# EAGLE design baseboard (EAGLE 5.10)

## Sheet 1 of 3
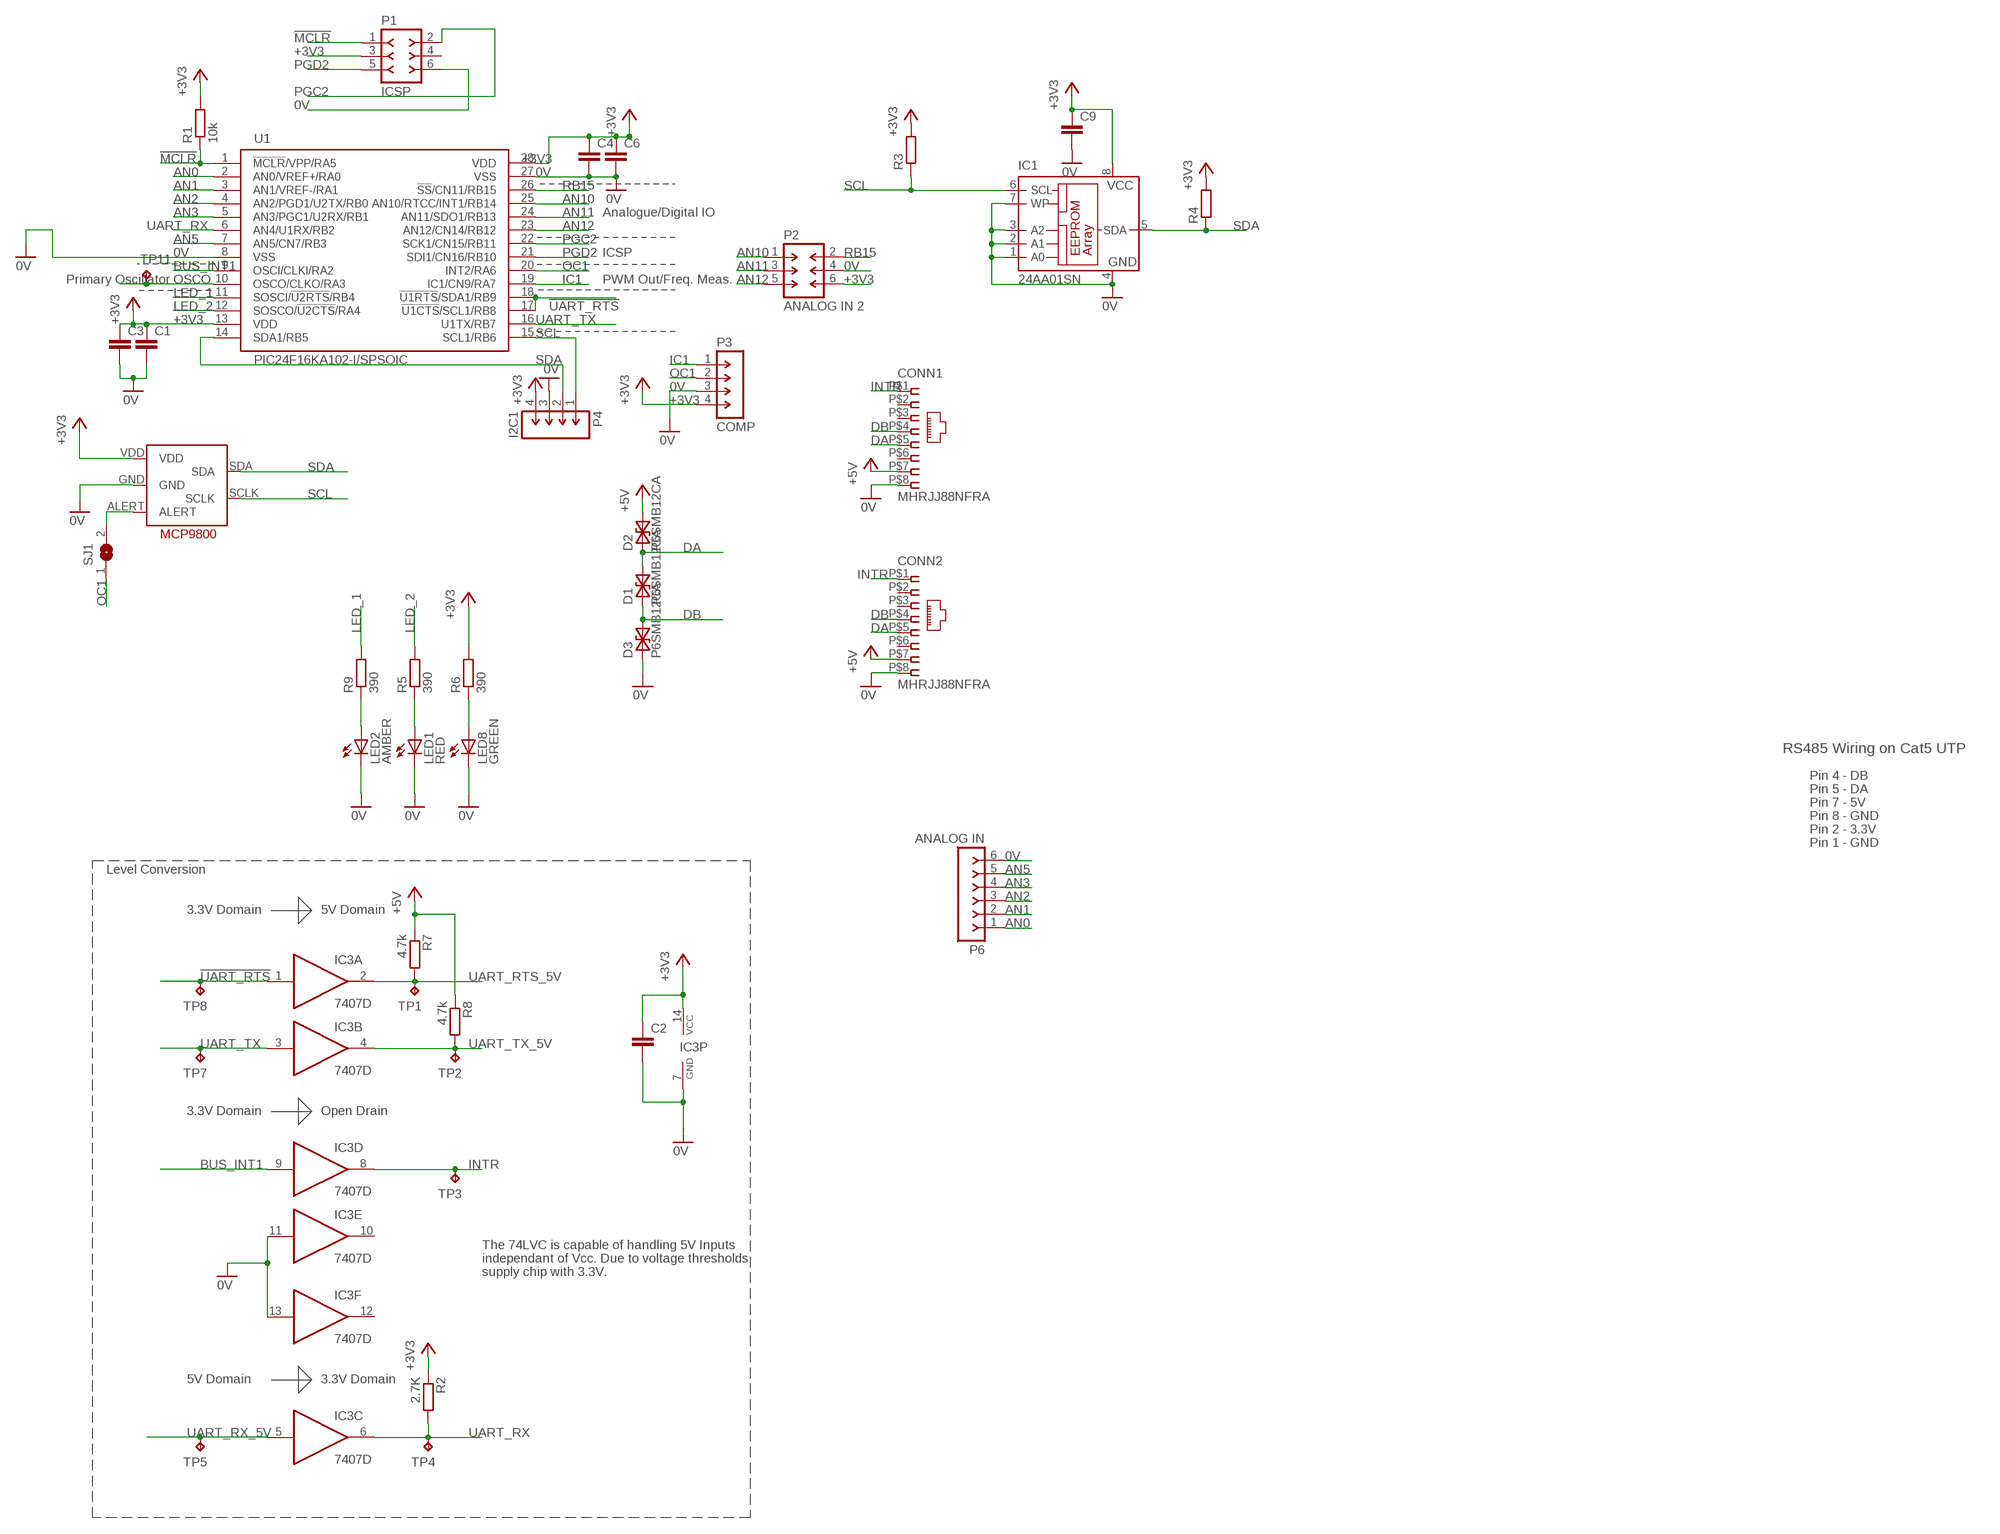
[diagram p0: schematic, sheet 1]

### Parts
C1  C-EUC0603  [C0603]
C2  C-EUC0603  [C0603]
C3  C-EUC0603  [C0603]
C4  C-EUC0603  [C0603]
C6  C-EUC0603  [C0603]
C9  C-EUC0603  [C0603]
CONN1  MHRJJ88NFRA  [MHRJJ8NFRA]
CONN2  MHRJJ88NFRA  [MHRJJ8NFRA]
D1  P6SMB12CA  [SMB]
D2  P6SMB12CA  [SMB]
D3  P6SMB12CA  [SMB]
IC1  24AA01SN  [SO-08]
IC3  7407D  [SO14]
LED1  RED  LEDP-LCC-2  [P-LCC-2]
LED2  AMBER  LEDP-LCC-2  [P-LCC-2]
LED8  GREEN  LEDP-LCC-2  [P-LCC-2]
P1  ICSP  F-2X03-DIL-100  [DIL-100-2X03]
P2  ANALOG IN 2  M-2X03-DIL-100  [DIL-100-2X03]
P3  COMP  M-1X04-SIP-100-40  [SIP-100-04-40]
P4  I2C1  M-1X04-SIP-100-40  [SIP-100-04-40]
P6  ANALOG IN  F-1X06-SIP-100-40  [SIP-100-06-40]
R1  10k  R-EU_R0805  [R0805]
R2  2.7K  R-EU_R0805  [R0805]
R3  R-EU_R0805  [R0805]
R4  R-EU_R0805  [R0805]
R5  390  R-EU_R0805  [R0805]
R6  390  R-EU_R0805  [R0805]
R7  4.7k  R-EU_R0805  [R0805]
R8  4.7k  R-EU_R0805  [R0805]
R9  390  R-EU_R0805  [R0805]
SJ1  SJ  [SJ]
TP1  TPTP13R  [TP13R]
TP2  TPTP13R  [TP13R]
TP3  TPTP13R  [TP13R]
TP4  TPTP13R  [TP13R]
TP5  TPTP13R  [TP13R]
TP7  TPTP13R  [TP13R]
TP8  TPTP13R  [TP13R]
TP11  TPTP13R  [TP13R]
U1  PIC24F16KA102-I/SPSOIC  [SO28W]
U$1  MCP9800  [SOT-23-5]

### Nets
0V: C1.2 C2.2 C3.2 C4.2 C6.2 C9.2 CONN1.P$8 CONN2.P$8 D3.1 IC1.1(A0) IC1.2(A1) IC1.3(A2) IC1.4(GND) IC1.7(WP) IC3.7(P:GND) IC3.11(E:I) IC3.13(F:I) LED1.C LED2.C LED8.C P1.6 P2.4 P3.3 P4.3 P6.6 U1.8(VSS) U1.27(VSS) U$1.GND ; also sheet 2,3
!MCLR!: P1.1 R1.1 U1.1(!MCLR!/VPP/RA5)
!UART_RTS!: IC3.1(A:I) TP8.TP U1.17(!U1CTS!/SCL1/RB8) U1.18(!U1RTS!/SDA1/RB9)
+3V3: C1.1 C2.1 C3.1 C4.1 C6.1 C9.1 IC1.8(VCC) IC3.14(P:VCC) P1.3 P2.6 P3.4 P4.4 R1.2 R2.1 R3.2 R4.2 R6.2 U1.13(VDD) U1.28(VDD) U$1.VDD ; also sheet 2
+5V: CONN1.P$7 CONN2.P$7 D2.2 R7.1 R8.1 ; also sheet 2,3
AN0: P6.1 U1.2(AN0/VREF+/RA0)
AN1: P6.2 U1.3(AN1/VREF-/RA1)
AN2: P6.3 U1.4(AN2/PGD1/U2TX/RB0)
AN3: P6.4 U1.5(AN3/PGC1/U2RX/RB1)
AN5: P6.5 U1.7(AN5/CN7/RB3)
AN10: P2.1 U1.25(AN10/RTCC/INT1/RB14)
AN11: P2.3 U1.24(AN11/SDO1/RB13)
AN12: P2.5 U1.23(AN12/CN14/RB12)
BUS_INT1: IC3.9(D:I) U1.9(OSCI/CLKI/RA2)
DA: CONN1.P$5 CONN2.P$5 D1.2 D2.1 ; also sheet 3
DB: CONN1.P$4 CONN2.P$4 D1.1 D3.2 ; also sheet 3
IC1: P3.1 U1.19(IC1/CN9/RA7)
INTR: CONN1.P$1 CONN2.P$1 IC3.8(D:O) TP3.TP
LED_1: R9.2 U1.11(SOSCI/!U2RTS!/RB4)
LED_2: R5.2 U1.12(SOSCO/!U2CTS!/RA4)
N$4: SJ1.2 U$1.ALERT
N$5: LED1.A R5.1
N$6: LED2.A R9.1
N$15: LED8.A R6.1
OC1: P3.2 SJ1.1 U1.20(INT2/RA6)
OSCO: TP11.TP U1.10(OSCO/CLKO/RA3)
PGC2: P1.2 U1.22(SCK1/CN15/RB11)
PGD2: P1.5 U1.21(SDI1/CN16/RB10)
RB15: P2.2 U1.26(!SS!/CN11/RB15)
SCL: IC1.6(SCL) P4.1 R3.1 U1.15(SCL1/RB6) U$1.SCLK
SDA: IC1.5(SDA) P4.2 R4.1 U1.14(SDA1/RB5) U$1.SDA
UART_RTS_5V: IC3.2(A:O) R7.2 TP1.TP ; also sheet 3
UART_RX: IC3.6(C:O) R2.2 TP4.TP U1.6(AN4/U1RX/RB2)
UART_RX_5V: IC3.5(C:I) TP5.TP ; also sheet 3
UART_TX: IC3.3(B:I) TP7.TP U1.16(U1TX/RB7)
UART_TX_5V: IC3.4(B:O) R8.2 TP2.TP ; also sheet 3
Unconnected: CONN1.P$2 CONN1.P$3 CONN1.P$6 CONN2.P$2 CONN2.P$3 CONN2.P$6 IC3.10(E:O) IC3.12(F:O) P1.4

### Notes on the sheet
- Analogue/Digital IO
- ICSP
- Primary Oscillator | PWM Out/Freq. Meas.
- RS485 Wiring on Cat5 UTP
- Pin 4 - DB
- Pin 5 - DA
- Pin 7 - 5V
- Pin 8 - GND
- Pin 2 - 3.3V
- Pin 1 - GND
- Level Conversion
- 3.3V Domain | 5V Domain
- 3.3V Domain | Open Drain
- The 74LVC is capable of handling 5V Inputs
- independant of Vcc. Due to voltage thresholds
- supply chip with 3.3V.
- 5V Domain | 3.3V Domain

## Sheet 2 of 3
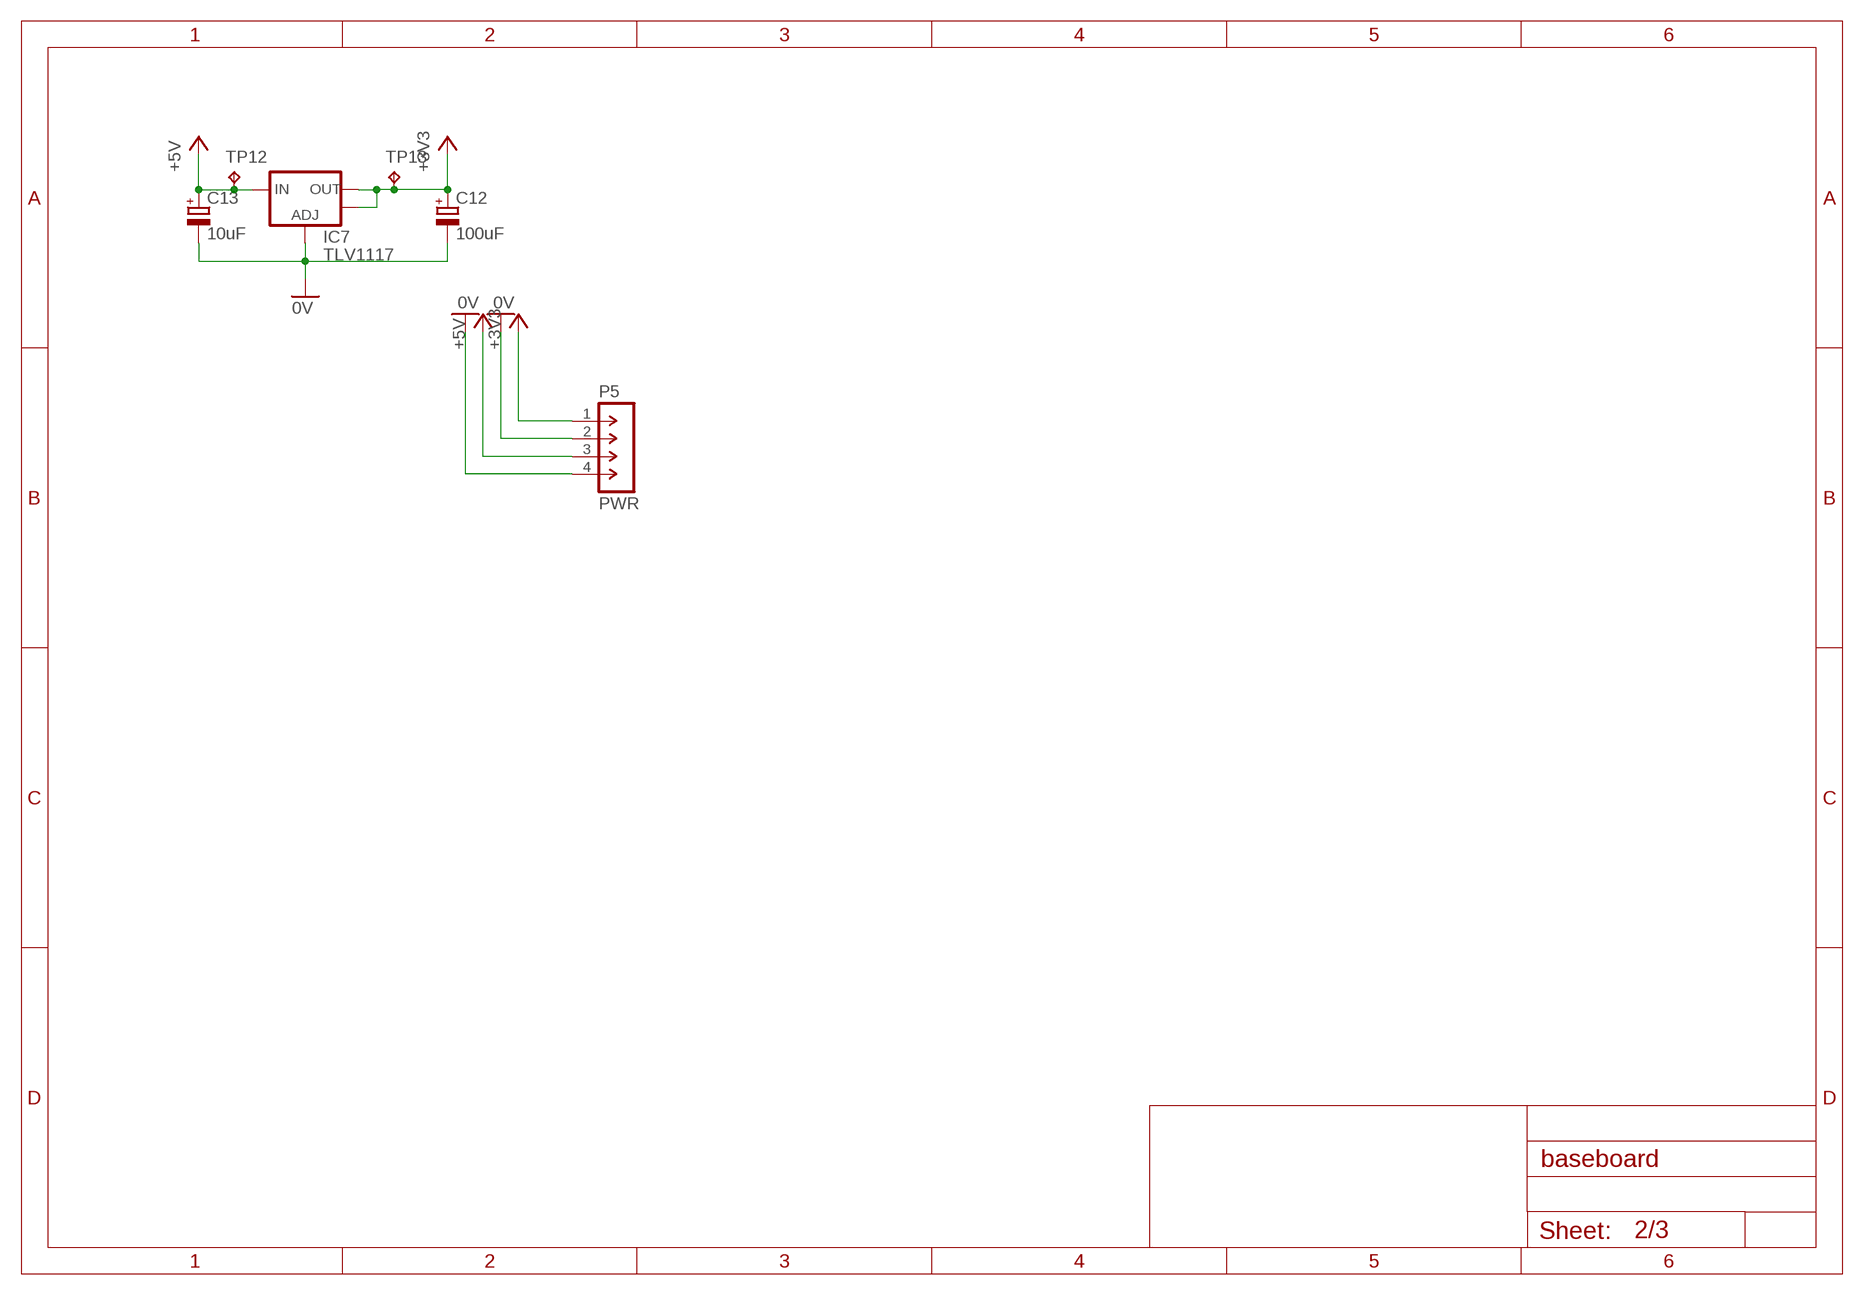
[diagram p1: schematic, sheet 2]

### Parts
C12  100uF  CPOL-EUB/3528-21R  [B/3528-21R]
C13  10uF  CPOL-EUC/6032-28R  [C/6032-28R]
IC7  TLV1117  V_REG_LM1117SOT223  [SOT223]
P5  PWR  M-1X04-SIP-100-40  [SIP-100-04-40]
TP12  TPTP15R  [TP15R]
TP13  3V3  TPTP15R  [TP15R]

### Nets
0V: C12.- C13.- IC7.1(ADJ) P5.2 P5.4 ; also sheet 1,3
+3V3: C12.+ IC7.2(OUT) IC7.4(OUT) P5.1 TP13.TP ; also sheet 1
+5V: C13.+ IC7.3(IN) P5.3 TP12.TP ; also sheet 1,3

## Sheet 3 of 3
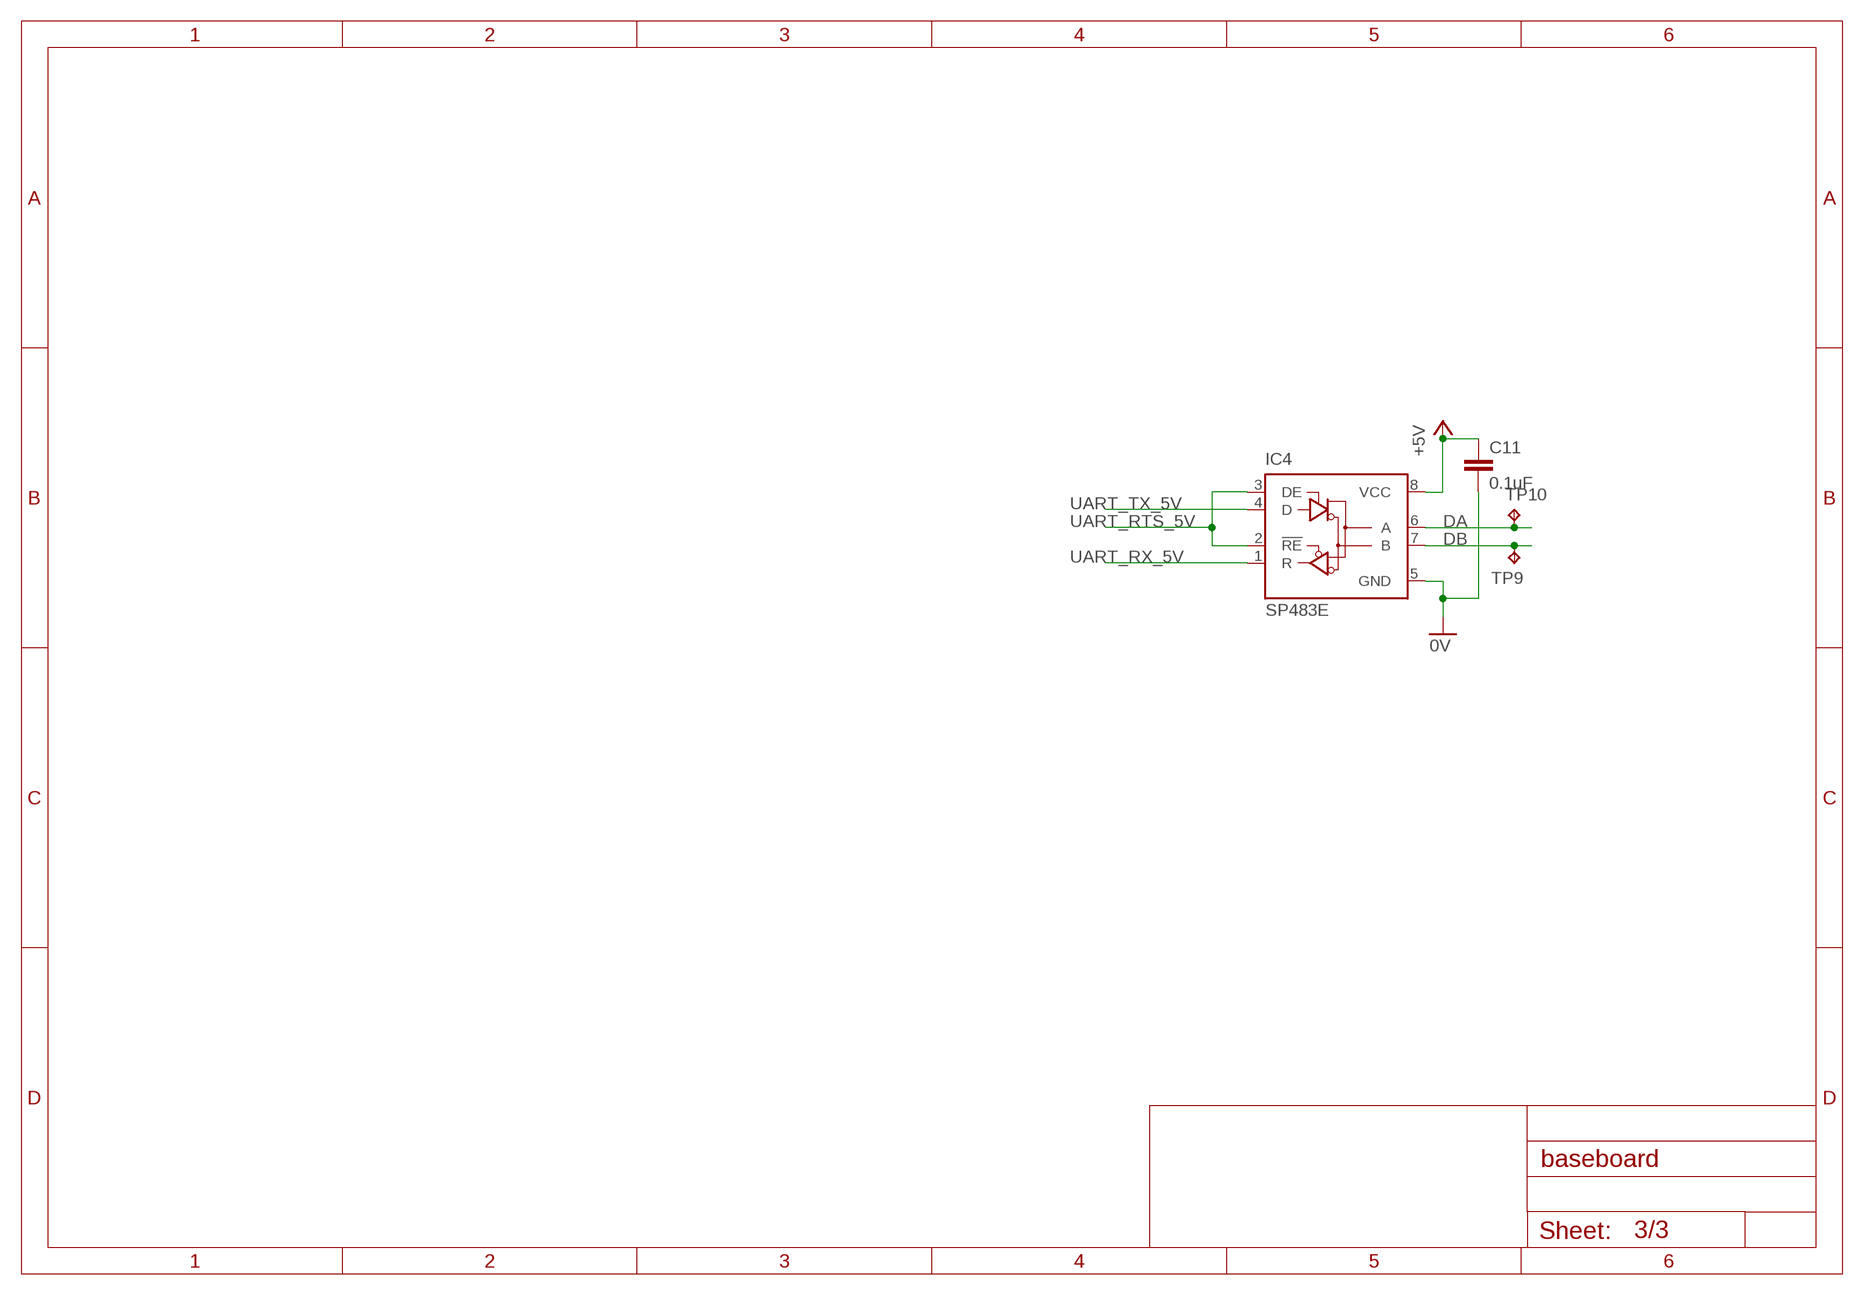
[diagram p2: schematic, sheet 3]

### Parts
C11  0.1uF  C-EUC1206  [C1206]
IC4  SP483E  75176AD  [D_R-PDSO-G8]
TP9  TPTP13R  [TP13R]
TP10  TPTP13R  [TP13R]

### Nets
0V: C11.2 IC4.5(GND) ; also sheet 1,2
+5V: C11.1 IC4.8(VCC) ; also sheet 1,2
DA: IC4.6(A) TP10.TP ; also sheet 1
DB: IC4.7(B) TP9.TP ; also sheet 1
UART_RTS_5V: IC4.2(!RE) IC4.3(DE) ; also sheet 1
UART_RX_5V: IC4.1(R) ; also sheet 1
UART_TX_5V: IC4.4(D) ; also sheet 1

## Library data of the parts
C1-C4 C6 C9 C11 = resistor:C-EU: CAPACITOR, European symbol
C12 C13 = resistor:CPOL-EU: POLARIZED CAPACITOR, European symbol
CONN1 CONN2 = eko-parts:MHRJJ88NFRA: http://onecall.farnell.com/mh-connectors/mhrjj88nfra/socket-rj45-8p8c/dp/3938360
D1-D3 = _hhn_suppressor_SMAJ_SM6T_P6SMB:P6SMB*CA: P6SMBxxCA Series of bidirectional Transient Voltage Suppressor Diodes xx = Stand-off Voltage VR in Volts; PPmax = 600 W Case: SMB = DO 214 AA Note: Footprint acc. to ST specs; source: www.st.com Author: Dipl.-Ing. FH Rainer Bayer, www.ing-rb.de/hhn Feedback: rainer.bayer@hs-heilbronn.de
IC1 = microchip:24*: Serial EEPROM I2C; MF: MICROCHIP; MPN: 24AA01/SN; OC_FARNELL: 1331268; OC_NEWARK: 89C9792
IC3 = 74xx-eu:74*07: Hex BUFFER, open collector high-voltage output
IC4 = 751xx:75176A: DIFFERENTIAL BUS TRANSCEIVER Source: http://focus.ti.com/lit/ds/symlink/sn75176a.pdf
IC7 = SparkFun:V_REG_LM1117: Voltage Regulator LM1117 Standard adjustable voltage regulator but in SMD form. Spark Fun Electronics SKU : COM-00595
LED1 LED2 LED8 = led:LED: LED OSRAM: - CHIPLED LG R971, LG N971, LY N971, LG Q971, LY Q971, LO R971, LY R971 LH N974, LH R974 LS Q976, LO Q976, LY Q976 LO Q996 - Hyper CHIPLED LW Q18S LB Q993, LB Q99A, LB R99A - SideLED LS A670, LO A670, LY A670, LG A670, LP A670 LB A673, LV A673, LT A673, LW A673 LH A674 LY A675 LS A676, LA A676, LO A676, LY A676, LW A676 LS A679, LY A679, LG A679 - Hyper Micro SIDELED® LS Y876, LA Y876, LO Y876, LY Y876 LT Y87S - SmartLED LW L88C, LW L88S LB L89C, LB L89S, LG L890 LS L89K, LO L89K, LY L89K LS L896, LA L896, LO L896, LY L896 - TOPLED LS T670, LO T670, LY T670, LG T670, LP T670 LSG T670, LSP T670, LSY T670, LOP T670, LYG T670 LG T671, LOG T671, LSG T671 LB T673, LV T673, LT T673, LW T673 LH T674 LS T676, LA T676, LO T676, LY T676, LB T676, LH T676, LSB T676, LW T676 LB T67C, LV T67C, LT T67C, LS T67K, LO T67K, LY T67K, LW E67C LS E67B, LA E67B, LO E67B, LY E67B, LB E67C, LV E67C, LT E67C LW T67C LS T679, LY T679, LG T679 LS T770, LO T770, LY T770, LG T770, LP T770 LB T773, LV T773, LT T773, LW T773 LH T774 LS E675, LA E675, LY E675, LS T675 LS T776, LA T776, LO T776, LY T776, LB T776 LHGB T686 LT T68C, LB T68C - Hyper Mini TOPLED® LB M676 - Mini TOPLED Santana® LG M470 LS M47K, LO M47K, LY M47K Source: http://www.osram.convergy.de LUXEON: - LUMILED® LXK2-PW12-R00, LXK2-PW12-S00, LXK2-PW14-U00, LXK2-PW14-V00 LXK2-PM12-R00, LXK2-PM12-S00, LXK2-PM14-U00 LXK2-PE12-Q00, LXK2-PE12-R00, LXK2-PE12-S00, LXK2-PE14-T00, LXK2-PE14-U00 LXK2-PB12-K00, LXK2-PB12-L00, LXK2-PB12-M00, LXK2-PB14-N00, LXK2-PB14-P00, LXK2-PB14-Q00 LXK2-PR12-L00, LXK2-PR12-M00, LXK2-PR14-Q00, LXK2-PR14-R00 LXK2-PD12-Q00, LXK2-PD12-R00, LXK2-PD12-S00 LXK2-PH12-R00, LXK2-PH12-S00 LXK2-PL12-P00, LXK2-PL12-Q00, LXK2-PL12-R00 Source: www.luxeon.com KINGBRIGHT: KA-3528ASYC Source: www.kingbright.com
P1 = con-headers-jp:F-2X03-: FEMALE HEADER
P2 = con-headers-jp:M-2X03-: MALE HEADER
P3-P5 = con-headers-jp:M-1X04-: MALE HEADER
P6 = con-headers-jp:F-1X06-: FEMALE HEADER
R1-R9 = resistor:R-EU_: RESISTOR, European symbol
SJ1 = jumper:SJ: SMD solder JUMPER
TP1-TP5 TP7-TP13 = testpad:TP: Test pad
U1 = eko-parts:PIC24F16KA102-I/SP
U$1 = atmospheric:MCP9800

## Board
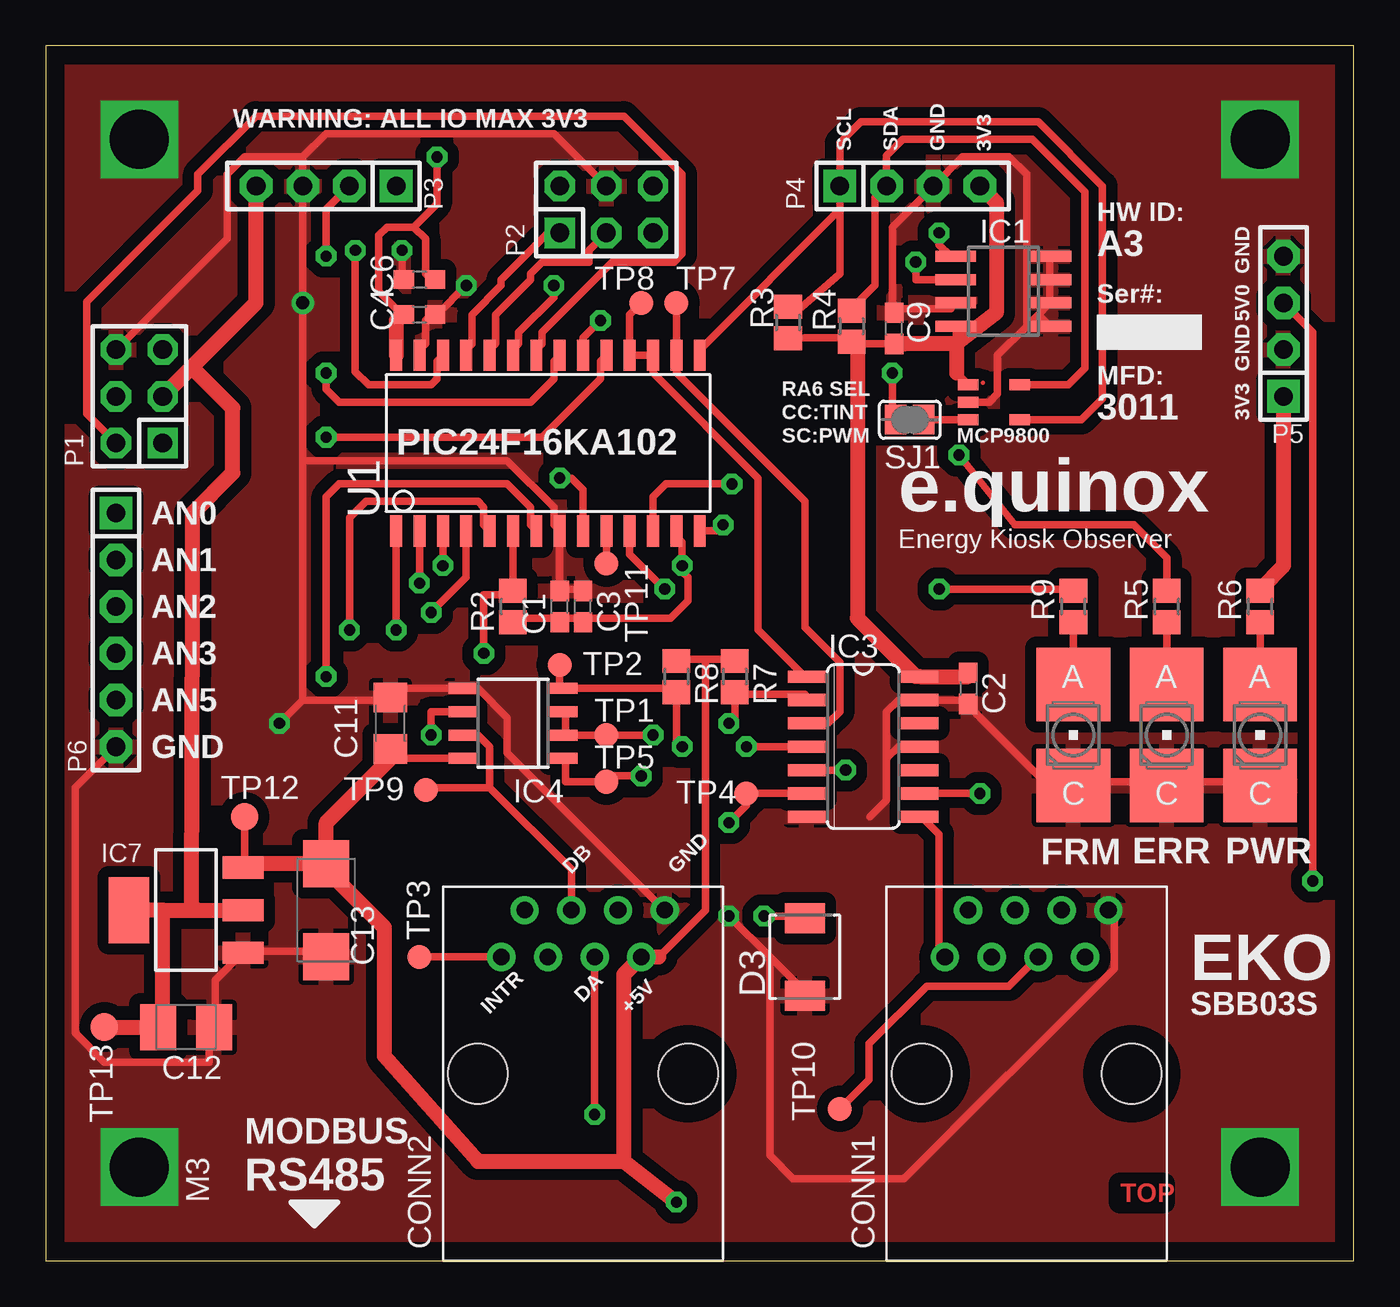
[diagram p3: board, top side]
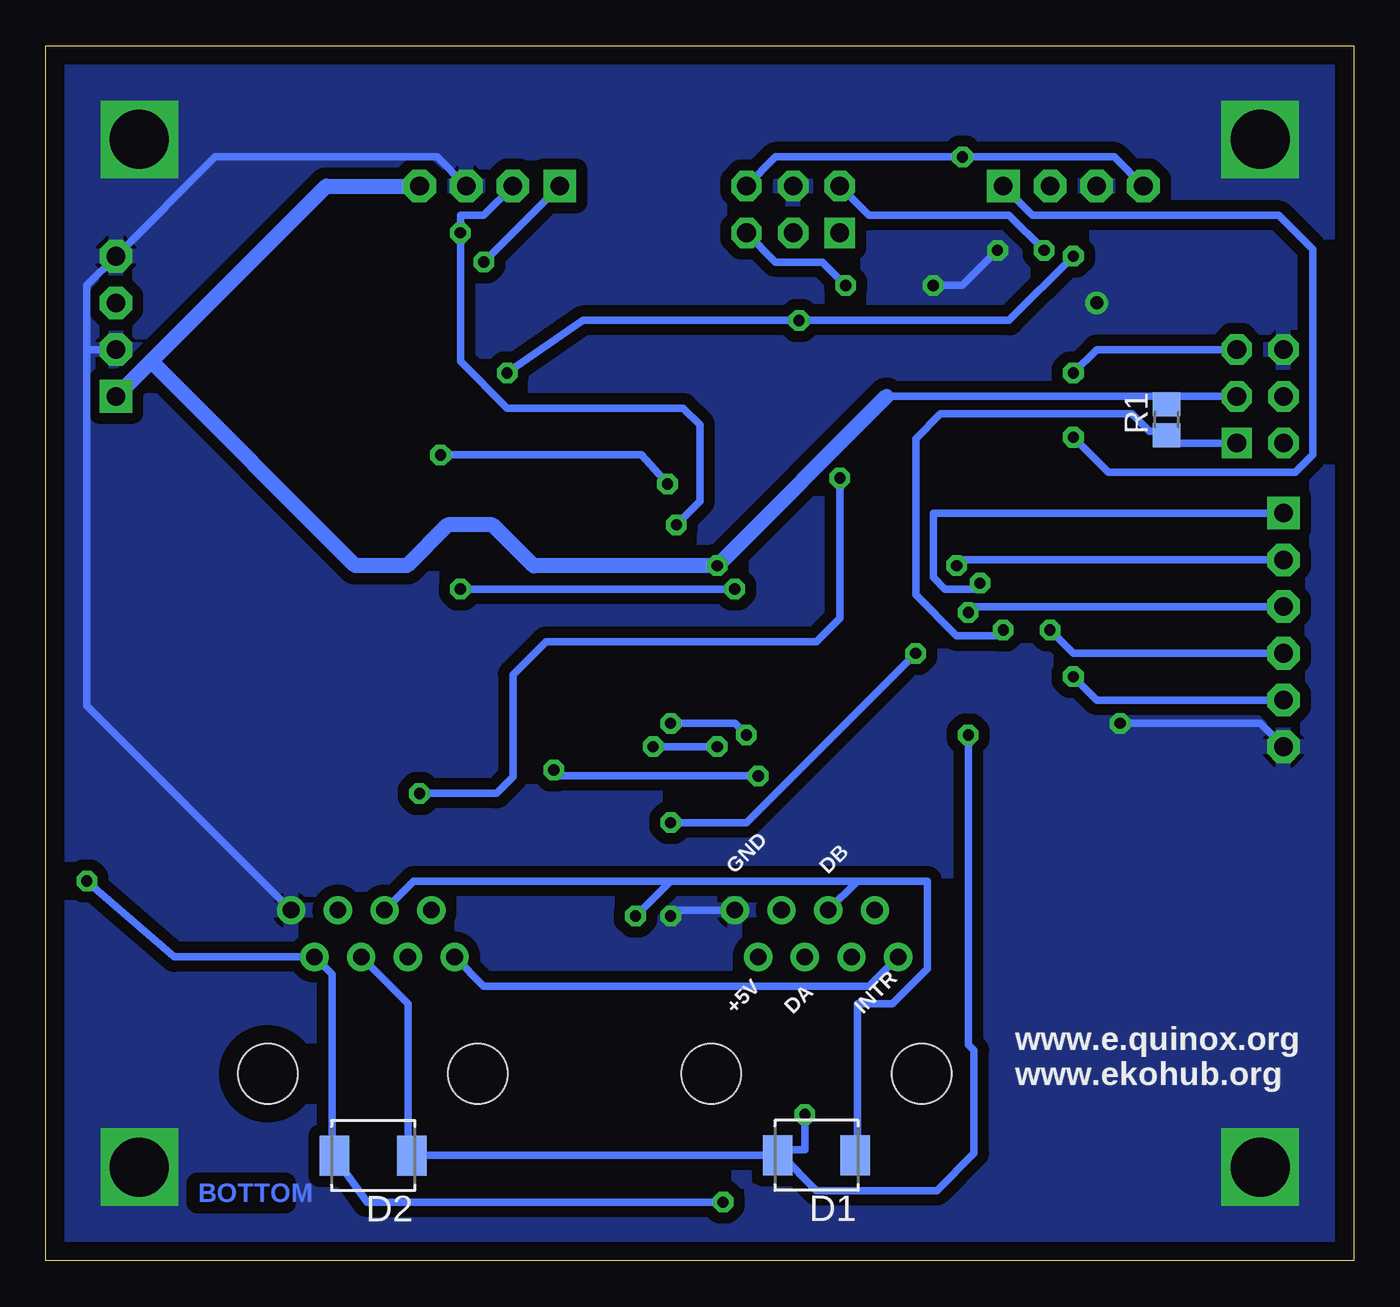
[diagram p4: board, bottom side, seen from below]

Size 71.12 x 66.04 mm. Coordinates in mm from the lower left corner, seen from the top.
Outline: 0,0 71.12,0 71.12,66.04 0,66.04 0,0
Copper layers (1*16): Top 0.035mm / dielectric 1.5mm / Bottom 0.035mm
Design rules "default *": minimum track width 16mil, minimum drill 24mil, track to track 15mil, track to pad 15mil, pad to pad 15mil, via to via 15mil, smd to smd 8mil, copper to edge 40mil, drill to drill 15mil, minimum pad ring 12.5mil, minimum via ring 10mil, stop-mask expansion 4mil, vias tented up to drill 0mil, thermal gap 10mil
vRestrict: area 52.1,49.5 to 57.1,54.6

### Footprints (pad centres in the part's own frame; a part is rotated, then mirrored left to right if it is on the bottom)
C0603 = smd 1.1 x 1: 1 -0.85,0; 2 0.85,0
C1206 = smd 1.6 x 1.8: 1 -1.4,0; 2 1.4,0
B/3528-21R = smd 1.95 x 2.5: + 1.525,0; - -1.525,0
C/6032-28R = smd 2.55 x 2.5: + 2.525,0; - -2.525,0
MHRJJ8NFRA = drill 0.9 round: P$1 -4.445,6.35; P$2 -3.175,8.89; P$3 -1.905,6.35; P$4 -0.635,8.89; P$5 0.635,6.35; P$6 1.905,8.89; P$7 3.175,6.35; P$8 4.445,8.89 | hole 3.25: -5.715,0; 5.715,0
SMB = smd 1.62 x 2.18: 1 -2.11,0; 2 2.11,0
SO-08 = smd 0.6 x 2.2: 1 -1.905,-2.6; 2 -0.635,-2.6; 3 0.635,-2.6; 4 1.905,-2.6; 5 1.905,2.6; 6 0.635,2.6; 7 -0.635,2.6; 8 -1.905,2.6
SO14 = smd 0.66 x 2.032: 1 -3.81,-3.073; 2 -2.54,-3.073; 3 -1.27,-3.073; 4 0,-3.073; 5 1.27,-3.073; 6 2.54,-3.073; 7 3.81,-3.073; 8 3.81,3.073; 9 2.54,3.073; 10 1.27,3.073; 11 0,3.073; 12 -1.27,3.073; 13 -2.54,3.073; 14 -3.81,3.073
D_R-PDSO-G8 = smd 0.6 x 1.5: 1 -1.905,-2.75; 2 -0.635,-2.75; 3 0.635,-2.75; 4 1.905,-2.75; 5 1.905,2.75; 6 0.635,2.75; 7 -0.635,2.75; 8 -1.905,2.75
SOT223 = smd 1.219 x 2.235: 1 -2.311,-3.099; 2 0,-3.099; 3 2.311,-3.099 | smd 3.6 x 2.2: 4 0,3.099
P-LCC-2 = smd 4 x 4: A 0,2.75; C 0,-2.75
DIL-100-2X03 = drill 1.016 square: 1 -2.54,-1.27 | drill 1.016 octagon: 2 -2.54,1.27; 3 0,-1.27; 4 0,1.27; 5 2.54,-1.27; 6 2.54,1.27
SIP-100-04-40 = drill 1.016 pad 1.778 square: 1 -3.81,0 | drill 1.016 pad 1.778 octagon: 2 -1.27,0; 3 1.27,0; 4 3.81,0
SIP-100-06-40 = drill 1.016 pad 1.778 square: 1 -6.35,0 | drill 1.016 pad 1.778 octagon: 2 -3.81,0; 3 -1.27,0; 4 1.27,0; 5 3.81,0; 6 6.35,0
R0805 = smd 1.3 x 1.5: 1 -0.85,0; 2 0.85,0
SJ = smd 1.168 x 1.6: 1 -0.762,0; 2 0.762,0
TP13R = smd 1.3 x 1.3: TP 0,0
TP15R = smd 1.5 x 1.5: TP 0,0
SO28W = smd 0.65 x 1.7: 1 -7.62,-4.78; 2 -6.35,-4.78; 3 -5.08,-4.78; 4 -3.81,-4.78; 5 -2.54,-4.78; 6 -1.27,-4.78; 7 0,-4.78; 8 1.27,-4.78; 9 2.54,-4.78; 10 3.81,-4.78; 11 5.08,-4.78; 12 6.35,-4.78; 13 7.62,-4.78; 14 8.89,-4.78; 15 8.89,4.78; 16 7.62,4.78; 17 6.35,4.78; 18 5.08,4.78; 19 3.81,4.78; 20 2.54,4.78; 21 1.27,4.78; 22 0,4.78; 23 -1.27,4.78; 24 -2.54,4.78; 25 -3.81,4.78; 26 -5.08,4.78; 27 -6.35,4.78; 28 -7.62,4.78
SOT-23-5 = smd 0.6 x 1.1: ALERT 1.9,0; GND 0.95,0; SCLK 1.9,2.8; SDA 0,2.8; VDD 0,0

### Placement (x,y rotation side)
C1  27.94,35.56 90 top
C2  50.16,31.11 270 top
C3  29.21,35.56 90 top
C4  20.32,51.44 0 top
C6  20.32,53.34 180 top
C9  46.13,50.69 90 top
C11  18.73,29.21 90 top
C12  7.62,12.7 180 top
C13  15.24,19.05 90 top
CONN1  53.34,10.16 0 top
CONN2  29.21,10.16 0 top
D1  29.21,5.73 180 bottom
D2  53.33,5.7 180 bottom
D3  41.27,16.51 90 top
IC1  52.07,52.7 90 top
IC3  44.45,27.94 270 top
IC4  25.4,29.21 90 top
IC7  7.62,19.05 90 top
LED1  60.96,28.57 0 top
LED2  55.88,28.57 0 top
LED8  66.04,28.57 0 top
P1  5.08,46.99 90 top
P2  30.48,57.15 0 top
P3  15.24,58.42 180 top
P4  46.99,58.42 0 top
P5  67.31,50.8 90 top
P6  3.81,34.29 270 top
R1  10.16,45.72 90 bottom
R2  25.4,35.56 90 top
R3  40.36,51 270 top
R4  43.81,50.8 270 top
R5  60.96,35.56 90 top
R6  66.04,35.56 90 top
R7  37.47,31.75 270 top
R8  34.29,31.75 270 top
R9  55.88,35.56 90 top
SJ1  46.99,45.72 0 top
TP1  30.48,28.57 0 top
TP2  27.94,32.38 0 top
TP3  20.32,16.51 0 top
TP4  38.1,25.4 0 top
TP5  30.48,26.04 0 top
TP7  34.29,52.07 0 top
TP8  32.38,52.07 0 top
TP9  20.65,25.58 0 top
TP10  43.18,8.26 0 top
TP11  30.48,37.9 0 top
TP12  10.79,24.13 0 top
TP13  3.17,12.7 0 top
U1  26.67,44.45 0 top
U$1  50.16,47.62 270 top

### Tracks (layer width: path | path; a pad name or v marks a point on that pad's centre or on a via)
0V  (via drill 0.61, 0.7, 3.2 pad 0.41)
  Top 0.406: IC1.7 49.21,52.07 49.21,51.75 46.67,51.75 C9.2 46.35,51.75 46.04,52.07 46.04,56.2 P4.3 49.85,60.01 52.39,60.01 53.34,59.05 53.34,50.8 | 54.61,53.34 54.61,54.61 IC1.4 | 53.98,51.44 54.61,52.07 | 53.34,50.8 53.98,51.44 | 53.34,50.8 51.75,49.21 51.75,47.12 51.3,46.67 U$1.GND | 53.98,51.44 54.61,50.8 IC1.1 | 54.61,52.07 54.61,53.34 | 54.61,53.34 IC1.3 | 54.61,52.07 IC1.2 | C13.- 15.24,16.83 10.79,16.83 IC7.1 10.48,16.51 9.21,15.24 9.21,12.7 C12.- 8.89,12.7 8.89,10.79 3.17,10.79 1.59,12.38 1.59,25.72 P6.6 | v37.15,18.73 39.37,16.51 | 39.37,16.51 41.27,14.61 D3.1 | 27.94,36.51 29.21,36.51 C3.2 | 27.94,36.51 C1.2 | 27.94,36.51 U1.8 27.94,39.69 27.62,40.01 27.62,40.96 25.08,43.5 13.97,43.5 | 13.97,43.5 v13.97,52.07 P3.3 13.97,60.01 | 13.97,30.48 18.73,30.48 C11.2 18.73,31.11 IC4.5 23.5,31.11 25.08,29.53 25.08,27.62 CONN2.P$8 | 13.97,30.48 13.97,43.5 | P1.6 9.84,55.56 9.84,59.05 10.79,60.01 13.97,60.01 | P2.4 27.62,61.28 15.24,61.28 13.97,60.01 | v12.7,29.21 13.97,30.48 | CONN1.P$8 58.1,18.73 58.1,15.88 46.67,4.45 40.64,4.45 39.37,5.71 39.37,16.51 | 66.04,26.04 54.29,26.04 50.16,30.16 C2.2 | 50.16,30.48 IC3.13 46.35,30.48 45.72,29.84 45.72,27.3 | 45.72,27.3 46.35,27.94 IC3.11 | 44.82,24.13 45.72,25.03 45.72,27.3 | U1.27 20.32,49.53 20.64,49.85 20.64,51.12 20.95,51.44 C4.2 21.27,51.44 v22.86,53.02 | v19.37,54.93 19.37,53.34 C6.2
  Bottom 0.406: CONN1.P$8 68.9,30.16 68.9,49.53 | 68.9,49.53 P5.2 | 68.9,49.53 68.9,53.02 P5.4 61.91,60.01 49.85,60.01 P4.3 | v37.15,18.73 36.83,19.05 CONN2.P$8 | P6.6 5.08,29.21 v12.7,29.21 | v19.37,54.93 21.27,53.02 v22.86,53.02
  other vias: 5.08,5.08 5.08,60.96 66.04,60.96 66.04,5.08
  pour Top (isolate 0.61): 0,66.04 71.12,66.04 71.12,0 0,0
  pour Bottom (isolate 0.61): 0,66.04 71.12,66.04 71.12,0 0,0
!MCLR!  (via drill 0.61)
  Top 0.406: v19.05,34.29 U1.1
  Bottom 0.406: P1.1 9.84,44.45 10.16,44.77 R1.1 10.16,45.09 11.11,45.09 12.06,46.04 22.46,46.04 23.81,44.69 23.81,36.2 21.59,33.97 19.37,33.97 v19.05,34.29
!UART_RTS!
  Top 0.406: TP8.TP 31.75,51.44 U1.18 31.75,49.21 33.02,49.21 | 33.02,49.21 33.02,48.26 38.73,42.55 38.73,34.29 41.27,31.75 IC3.1 | 33.02,49.21 U1.17
+3V3  (via drill 0.61)
  Top 0.406: 66.04,36.51 R6.2 | 49.53,48.26 U$1.VDD | 49.53,49.85 49.53,50.8 IC1.8 | 50.16,31.75 C2.1 | 44.13,49.85 43.81,49.85 R4.2 | 44.13,49.85 46.35,49.85 C9.1 46.67,49.85 | R3.2 41.27,50.16 43.81,50.16 R4.2 | 47.31,31.75 IC3.14 | 44.13,49.85 R4.2 | C12.+ 6.35,12.7 | 29.21,34.92 27.94,34.92 | 27.94,34.92 25.4,34.92 R2.1 | 27.94,34.92 C1.1 | 29.21,34.92 33.97,34.92 34.92,35.88 34.92,37.15 34.61,37.47 v34.61,37.78 34.61,39.05 34.29,39.37 U1.13 | 29.21,34.92 C3.1 | 19.37,51.44 19.05,51.12 | 20,56.2 20.64,55.56 20.64,53.66 20.95,53.34 C6.1 | 20,56.2 18.55,56.2 18.1,55.75 18.1,52.7 19.37,51.44 | 19.37,51.44 C4.1 | 20,56.2 21.27,57.47 v21.27,60.01
  Top 0.813: 66.04,36.51 67.31,37.78 P5.1 | 49.53,49.85 49.53,48.26 | IC3.14 50.16,31.75 | 47.31,31.75 44.13,34.92 44.13,49.85 | 49.53,49.85 46.67,49.85 | P4.4 51.69,57.56 51.69,51.52 49.53,49.85 | TP13.TP C12.+ | 6.35,19.05 7.94,19.05 | 7.94,19.05 8.26,19.05 IC7.2 | 6.35,19.05 IC7.4 | 6.35,12.7 6.35,19.05 | 19.05,51.12 U1.28 | 7.94,48.58 11.43,52.07 P3.4 | 7.94,48.58 P1.3 | 7.94,19.05 7.98,35.97 7.98,40.64 10.16,42.82 10.16,46.35 7.94,48.58
  Bottom 0.406: 9.84,46.99 10.16,46.67 R1.2 9.84,46.99 | P1.3 9.84,46.99 | P2.6 31.43,60.01 v21.27,60.01 13.02,60.01 P3.4 | 9.84,46.99 25.4,46.99
  Bottom 0.813: 65.41,48.9 55.88,58.42 P4.4 | 65.41,48.9 P5.1 | 25.4,46.99 v34.61,37.78 44.6,37.77 45.8,38.97 46.83,40.01 49.27,40.01 51.49,37.78 54.29,37.78 65.41,48.9
+5V  (via drill 0.61)
  Top 0.406: IC4.8 18.73,27.3 C11.1 18.73,27.62 | TP12.TP 10.79,21.59 IC7.3 | 15.24,21.59 C13.+ 15.24,21.27 | 35.88,32.7 37.47,32.7 R7.1 | 35.88,32.7 34.29,32.7 R8.1 | 35.88,32.7 35.88,19.05 33.34,16.51 | P5.3 68.9,50.48 v68.9,20.64
  Top 0.813: 10.79,21.59 15.24,21.59 15.24,23.81 18.73,27.3 | 33.34,16.51 CONN2.P$7 31.43,15.56 31.43,5.4 | 15.24,21.27 18.41,18.1 18.41,11.11 23.5,5.4 31.43,5.4 | 31.43,5.4 v34.29,3.17
  Bottom 0.406: v68.9,20.64 64.14,16.51 CONN1.P$7 55.56,15.56 55.56,5.71 D2.2 55.24,5.4 53.66,3.17 v34.29,3.17
AN0  (via drill 0.61)
  Top 0.406: v20.32,36.83 U1.2
  Bottom 0.406: v20.32,36.83 20.64,36.51 22.23,36.51 22.86,37.15 22.86,40.64 P6.1
AN1  (via drill 0.61)
  Top 0.406: v21.59,37.78 U1.3
  Bottom 0.406: v21.59,37.78 21.27,38.1 P6.2
AN2  (via drill 0.61)
  Top 0.406: v20.95,35.24 22.86,37.15 U1.4
  Bottom 0.406: v20.95,35.24 20.64,35.56 P6.3
AN3  (via drill 0.61)
  Top 0.406: v16.51,34.29 16.51,40.38 17.41,41.27 23.5,41.27 23.81,40.96 23.81,40.01 24.13,39.69 U1.5
  Bottom 0.406: v16.51,34.29 15.24,33.02 P6.4
AN5  (via drill 0.61)
  Top 0.406: v15.24,31.75 15.24,41.52 15.95,42.23 25.08,42.23 26.35,40.96 26.35,40.01 26.67,39.69 U1.7
  Bottom 0.406: v15.24,31.75 13.97,30.48 P6.5
AN10
  Top 0.406: P2.1 27.3,55.88 24.77,53.34 24.77,53.02 23.18,51.44 23.18,49.85 22.86,49.53 U1.25
AN11
  Top 0.406: P2.3 29.53,54.93 29.53,54.29 26.99,54.29 26.35,53.66 26.35,53.34 24.45,51.44 24.45,49.85 24.13,49.53 U1.24
AN12  (via drill 0.61)
  Top 0.406: v27.62,53.02 27.62,52.39 25.72,50.48 25.72,49.85 25.4,49.53 U1.23
  Bottom 0.406: v27.62,53.02 28.89,54.29 31.43,54.29 P2.5
BUS_INT1  (via drill 0.61)
  Top 0.406: v50.8,25.4 IC3.9 | U1.9 29.21,41.91 28.57,42.55 v27.94,42.55
  Bottom 0.406: v27.94,42.55 27.94,34.92 29.21,33.66 43.92,33.66 45.72,31.86 45.72,26.3 46.62,25.4 v50.8,25.4
DA  (via drill 0.61)
  Top 0.406: TP10.TP 44.77,9.84 44.77,11.78 47.91,14.92 52.39,14.92 CONN1.P$5 | v20.95,28.57 20.95,29.84 IC4.6 | v29.84,7.94 CONN2.P$5
  Bottom 0.406: CONN1.P$5 52.39,14.92 51.44,13.97 51.44,5.71 D2.1 51.12,5.71 31.43,5.71 D1.2 | v20.95,28.57 20.95,11.75 20.64,11.43 20.64,5.84 22.67,3.81 29.21,3.81 31.11,5.71 D1.2 | v29.84,7.94 29.84,6.03 31.11,6.03 D1.2
DB  (via drill 0.61)
  Top 0.406: 24.13,25.72 20.95,25.72 TP9.TP | 24.13,25.72 24.13,27.94 23.5,28.57 IC4.7 | v39.05,18.73 41.27,18.73 D3.2 | 24.13,25.72 28.57,21.27 CONN2.P$4
  Bottom 0.406: 26.99,20.64 23.18,20.64 23.18,15.88 25.08,13.97 26.99,13.97 26.99,6.03 D1.1 | 26.99,20.64 CONN2.P$4 | 37.15,20.64 v39.05,18.73 | 26.99,20.64 37.15,20.64 | CONN1.P$4 51.12,20.64 37.15,20.64
IC1  (via drill 0.61)
  Top 0.406: v15.24,44.77 26.99,44.77 30.16,47.94 30.16,48.9 30.48,49.21 U1.19
  Bottom 0.406: v15.24,44.77 13.34,42.86 3.17,42.86 2.22,43.81 2.22,54.98 4.07,56.83 17.46,56.83 P3.1
INTR
  Top 0.406: TP3.TP CONN2.P$1 | CONN1.P$1 48.58,16.83 48.58,23.18 47.62,24.13 IC3.8
  Bottom 0.406: CONN2.P$1 26.35,14.92 47.31,14.92 CONN1.P$1
LED_1  (via drill 0.61)
  Top 0.406: v48.58,36.51 55.88,36.51 R9.2 | v33.66,36.51 31.75,38.42 U1.11
  Bottom 0.406: v33.66,36.51 v48.58,36.51
LED_2  (via drill 0.61)
  Top 0.406: v49.66,43.8 52.7,40.01 59.16,40.01 60.96,38.21 R5.2 | U1.12 33.02,41.52 33.73,42.23 v37.31,42.23
  Bottom 0.406: v37.31,42.23 38.73,43.81 39.04,43.8 v49.66,43.8
N$4
  Top 0.406: U$1.ALERT SJ1.2
N$5
  Top 0.406: LED1.A R5.1
N$6
  Top 0.406: LED2.A R9.1
N$15
  Top 0.406: LED8.A R6.1
OC1  (via drill 0.61)
  Top 0.406: v46.04,48.26 46.04,45.72 | v30.16,51.12 29.21,50.16 U1.20 | P3.2 15.24,57.15 v15.24,54.61
  Top 0.813: 46.04,45.72 SJ1.1
  Bottom 0.406: v46.04,48.26 41.91,51.12 v30.16,51.12 18.73,51.12 v15.24,54.61
OSCO
  Top 0.406: TP11.TP U1.10
PGC2
  Top 0.406: P1.2 2.22,46.04 2.22,52.14 8.26,58.17 8.26,59.05 11.43,62.23 31.43,62.23 34.61,59.05 34.61,54.74 34.16,54.29 30.8,54.29 26.99,50.48 26.99,49.85 26.67,49.53 U1.22
PGD2  (via drill 0.61)
  Top 0.406: v15.24,48.26 15.24,47.38 15.95,46.67 26.35,46.67 27.62,47.94 27.62,48.9 27.94,49.21 U1.21
  Bottom 0.406: v15.24,48.26 13.97,49.53 P1.5
RB15  (via drill 0.61)
  Top 0.406: v16.83,54.93 16.83,48.34 17.54,47.62 20.95,47.62 21.27,47.94 21.27,48.9 21.59,49.21 U1.26
  Bottom 0.406: v16.83,54.93 18.73,56.83 26.35,56.83 P2.2
SCL  (via drill 0.61)
  Top 0.406: U$1.SCLK 53.02,45.72 56.32,45.72 57.47,46.87 57.47,58.42 53.98,61.91 44.33,61.91 43.18,60.77 P4.1 43.18,57.15 | 43.18,57.15 43.18,53.66 41.1,51.83 R3.1 | 43.18,57.15 35.56,49.53 U1.15 | v47.31,54.29 47.31,53.34 IC1.6
  Bottom 0.406: P4.1 v47.31,54.29
SDA  (via drill 0.61)
  Top 0.406: U$1.SDA 55.62,47.62 56.52,48.52 56.52,58.1 53.66,60.96 46.62,60.96 45.72,60.06 P4.2 45.09,57.78 45.09,53.02 43.81,51.75 R4.1 | v36.83,40.01 36.83,39.69 35.56,39.69 U1.14 | v48.58,55.88 48.58,55.24 49.21,54.61 IC1.5
  Bottom 0.406: v36.83,40.01 35.56,41.27 35.56,45.46 36.46,46.35 46.04,46.35 48.58,48.9 v48.58,55.88 48.58,56.83 47.31,56.83 P4.2
UART_RTS_5V  (via drill 0.61)
  Top 0.406: 28.26,28.57 TP1.TP v33.02,28.57 | 28.26,28.57 28.26,29.84 IC4.3 | IC4.2 28.26,28.57 | 37.47,30.8 41.27,30.8 41.27,30.48 IC3.2 | v37.15,29.21 37.47,29.53 37.47,30.8 | 37.47,30.8 R7.2
  Bottom 0.406: v33.02,28.57 33.66,29.21 v37.15,29.21
UART_RX  (via drill 0.61)
  Top 0.406: U1.6 R2.2 25.4,36.2 23.81,36.2 v23.81,33.02 | IC3.6 TP4.TP 38.1,24.77 v37.15,23.81
  Bottom 0.406: v23.81,33.02 33.02,23.81 v37.15,23.81
UART_RX_5V  (via drill 0.61)
  Top 0.406: IC4.1 28.26,27.3 28.26,26.04 TP5.TP 30.48,26.35 v32.38,26.35 | v43.5,26.67 IC3.5
  Bottom 0.406: v43.5,26.67 43.18,26.35 v32.38,26.35
UART_TX
  Top 0.406: TP7.TP U1.16 34.29,48.26 41.27,41.27 41.27,34.44 43.18,32.53 43.18,29.84 42.55,29.21 IC3.3
UART_TX_5V  (via drill 0.61)
  Top 0.406: TP2.TP 27.94,31.11 IC4.4 34.29,31.11 R8.2 34.29,28.26 v34.61,27.94 | v38.1,27.94 IC3.4
  Bottom 0.406: v34.61,27.94 v38.1,27.94

### Text on the board
Top: TOP
Bottom: BOTTOM
bPlace: www.e.quinox.org | www.ekohub.org
tNames: WARNING: ALL IO MAX 3V3 | SCL | SDA | GND | 3V3 | HW ID: | A3 | GND | Ser#: | 5V0 | MFD: | GND | RA6 SEL | CC:TINT | 3011 | 3V3 | PIC24F16KA102 | SC:PWM | MCP9800 | e.quinox | AN0 | Energy Kiosk Observer | AN1 | AN2 | AN3 | AN5 | GND | FRM | ERR | PWR | DB | GND | EKO | DA | INTR | +5V | SBB03S | MODBUS | RS485 | M3
bNames: DB | GND | INTR | DA | +5V